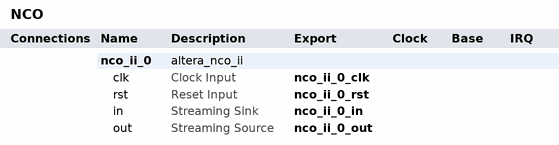
[diagram p0: system contents]
# Platform Designer (Qsys) system NCO, Cyclone V 5CEBA4F23C7
# Parameters at their usual value, and those the tool derives, are not listed.
package require -exact qsys 17.0
create_system NCO
set_project_property DEVICE_FAMILY {Cyclone V}
set_project_property DEVICE 5CEBA4F23C7

add_instance nco_ii_0 altera_nco_ii 17.0
set_instance_parameter_value nco_ii_0 apr 16
set_instance_parameter_value nco_ii_0 apri 16
set_instance_parameter_value nco_ii_0 arch large_rom
set_instance_parameter_value nco_ii_0 freq_out 25.0
set_instance_parameter_value nco_ii_0 fsamp 100.0
set_instance_parameter_value nco_ii_0 mpr 16
set_instance_parameter_value nco_ii_0 selected_device_family {Cyclone V}
set_instance_parameter_value nco_ii_0 want_dither false
set_instance_parameter_value nco_ii_0 want_sin_and_cos single_output

# exported interfaces
add_interface nco_ii_0_clk clock sink
set_interface_property nco_ii_0_clk EXPORT_OF nco_ii_0.clk
add_interface nco_ii_0_in avalon_streaming sink
set_interface_property nco_ii_0_in EXPORT_OF nco_ii_0.in
add_interface nco_ii_0_out avalon_streaming source
set_interface_property nco_ii_0_out EXPORT_OF nco_ii_0.out
add_interface nco_ii_0_rst reset sink
set_interface_property nco_ii_0_rst EXPORT_OF nco_ii_0.rst

set_interconnect_requirement {$system} qsys_mm.clockCrossingAdapter HANDSHAKE
set_interconnect_requirement {$system} qsys_mm.enableEccProtection FALSE
set_interconnect_requirement {$system} qsys_mm.insertDefaultSlave FALSE
set_interconnect_requirement {$system} qsys_mm.maxAdditionalLatency 1

save_system NCO.qsys
